# EAGLE design motor_driver_v3.0 (EAGLE 6.5.0)
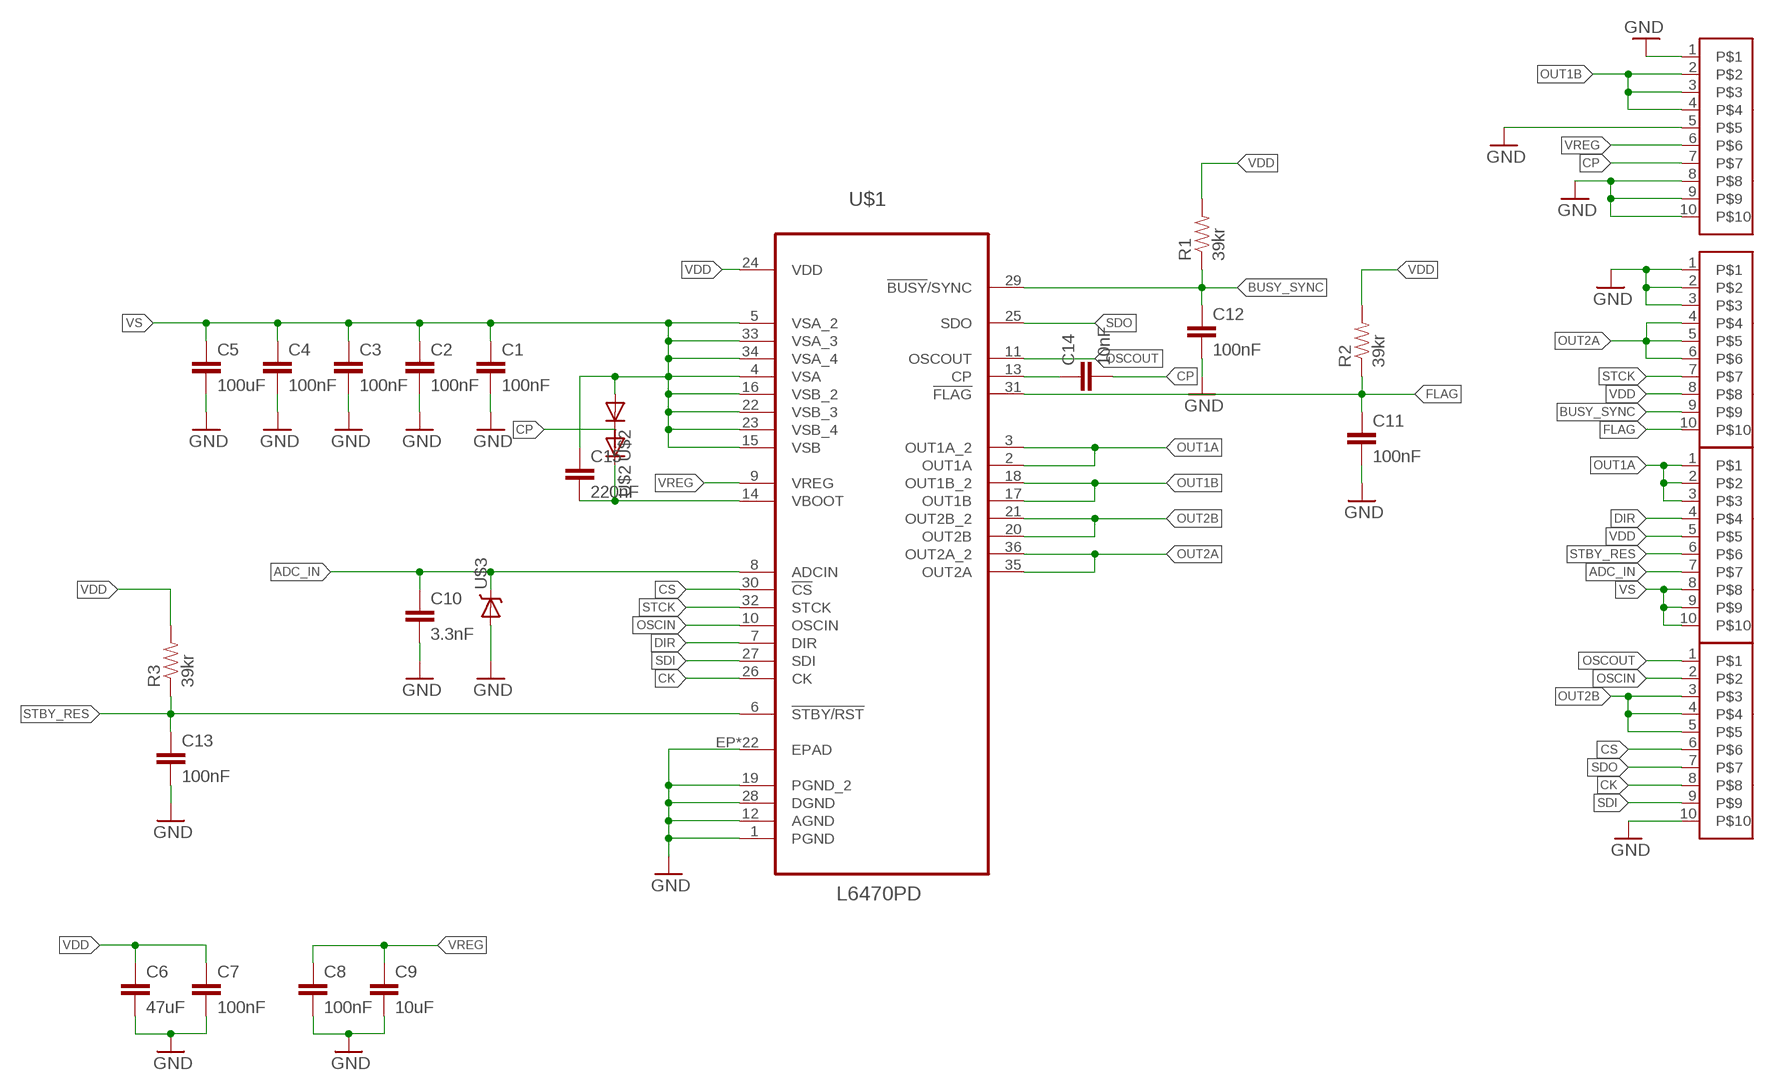
[diagram p0: schematic, sheet 1]

## Parts
C1  100nF  CAP0805  [0805-CAP]
C2  100nF  CAP0805  [0805-CAP]
C3  100nF  CAP0805  [0805-CAP]
C4  100nF  CAP0805  [0805-CAP]
C5  100uF  CAP  [CAP-10X12]
C6  47uF  CAP1206  [1206-CAP]
C7  100nF  CAP0805  [0805-CAP]
C8  100nF  CAP0805  [0805-CAP]
C9  10uF  CAP0805  [0805-CAP]
C10  3.3nF  CAP0805  [0805-CAP]
C11  100nF  CAP0805  [0805-CAP]
C12  100nF  CAP0805  [0805-CAP]
C13  100nF  CAP0805  [0805-CAP]
C14  10nF  CAP0805  [0805-CAP]
C15  220nF  CAP0805  [0805-CAP]
R1  39kr  RESISTOR  [0805]
R2  39kr  RESISTOR  [0805]
R3  39kr  RESISTOR  [0805]
U$1  L6470PD  [SOP65P1400X360-37N]
U$2  BAV99  [BAV99]
U$3  BZX585  [BZX585]
U$4  CON_TH_10PINS  [CON_TH_10POS]
U$5  CON_TH_10PINS  [CON_TH_10POS]
U$6  CON_TH_10PINS  [CON_TH_10POS]
U$7  CON_TH_10PINS  [CON_TH_10POS]

## Nets
ADC_IN: C10.P$1 U$1.8(ADCIN) U$3.P$1 U$4.7
BUSY_SYNC: C12.P$1 R1.1 U$1.29(!BUSY!/SYNC) U$5.9
CK: U$1.26(CK) U$7.8
CP: C14.P$2 U$2.P$3 U$6.7
CS: U$1.30(!CS) U$7.6
DIR: U$1.7(DIR) U$4.4
FLAG: C11.P$1 R2.1 U$1.31(!FLAG) U$5.10
GND: C1.P$2 C2.P$2 C3.P$2 C4.P$2 C5.P$2 C6.P$2 C7.P$2 C8.P$2 C9.P$2 C10.P$2 C11.P$2 C12.P$2 C13.P$2 U$1.1(PGND) U$1.12(AGND) U$1.19(PGND_2) U$1.28(DGND) U$1.EP(EPAD) U$1.VIA1(EPAD) U$1.VIA2(EPAD) U$1.VIA3(EPAD) U$1.VIA4(EPAD) U$1.VIA5(EPAD) U$1.VIA6(EPAD) U$1.VIA7(EPAD) U$1.VIA8(EPAD) U$1.VIA9(EPAD) U$1.VIA10(EPAD) U$1.VIA11(EPAD) U$1.VIA12(EPAD) U$1.VIA13(EPAD) U$1.VIA14(EPAD) U$1.VIA15(EPAD) U$1.VIA16(EPAD) U$1.VIA17(EPAD) U$1.VIA18(EPAD) U$1.VIA19(EPAD) U$1.VIA20(EPAD) U$1.VIA21(EPAD) U$3.P$2 U$5.1 U$5.2 U$5.3 U$6.1 U$6.5 U$6.8 U$6.9 U$6.10 U$7.10
N$1: C15.P$2 U$1.14(VBOOT) U$2.P$2
N$2: C14.P$1 U$1.13(CP)
OSCIN: U$1.10(OSCIN) U$7.2
OSCOUT: U$1.11(OSCOUT) U$7.1
OUT1A: U$1.2(OUT1A) U$1.3(OUT1A_2) U$4.1 U$4.2 U$4.3
OUT1B: U$1.17(OUT1B) U$1.18(OUT1B_2) U$6.2 U$6.3 U$6.4
OUT2A: U$1.35(OUT2A) U$1.36(OUT2A_2) U$5.4 U$5.5 U$5.6
OUT2B: U$1.20(OUT2B) U$1.21(OUT2B_2) U$7.3 U$7.4 U$7.5
SDI: U$1.27(SDI) U$7.9
SDO: U$1.25(SDO) U$7.7
STBY_RES: C13.P$1 R3.1 U$1.6(!STBY/RST) U$4.6
STCK: U$1.32(STCK) U$5.7
VDD: C6.P$1 C7.P$1 R1.2 R2.2 R3.2 U$1.24(VDD) U$4.5 U$5.8
VREG: C8.P$1 C9.P$1 U$1.9(VREG) U$6.6
VS: C1.P$1 C2.P$1 C3.P$1 C4.P$1 C5.P$1 C15.P$1 U$1.4(VSA) U$1.5(VSA_2) U$1.15(VSB) U$1.16(VSB_2) U$1.22(VSB_3) U$1.23(VSB_4) U$1.33(VSA_3) U$1.34(VSA_4) U$2.P$1 U$4.8 U$4.9 U$4.10

## Library data of the parts
C1-C15 = Usefull_ICs:CAP: Capacitor Standard 0603 ceramic capacitor, and 0.1" leaded capacitor.
R1-R3 = Usefull_ICs:RESISTOR: Resistor Basic schematic elements and footprints for 0603, 1206, and PTH 1/10th watt (small) resistors.
U$1 = Usefull_ICs:L6470PD
U$2 = Usefull_ICs:BAV99
U$3 = Usefull_ICs:BZX585
U$4-U$7 = Usefull_ICs:CON_TH_10PINS

## Board
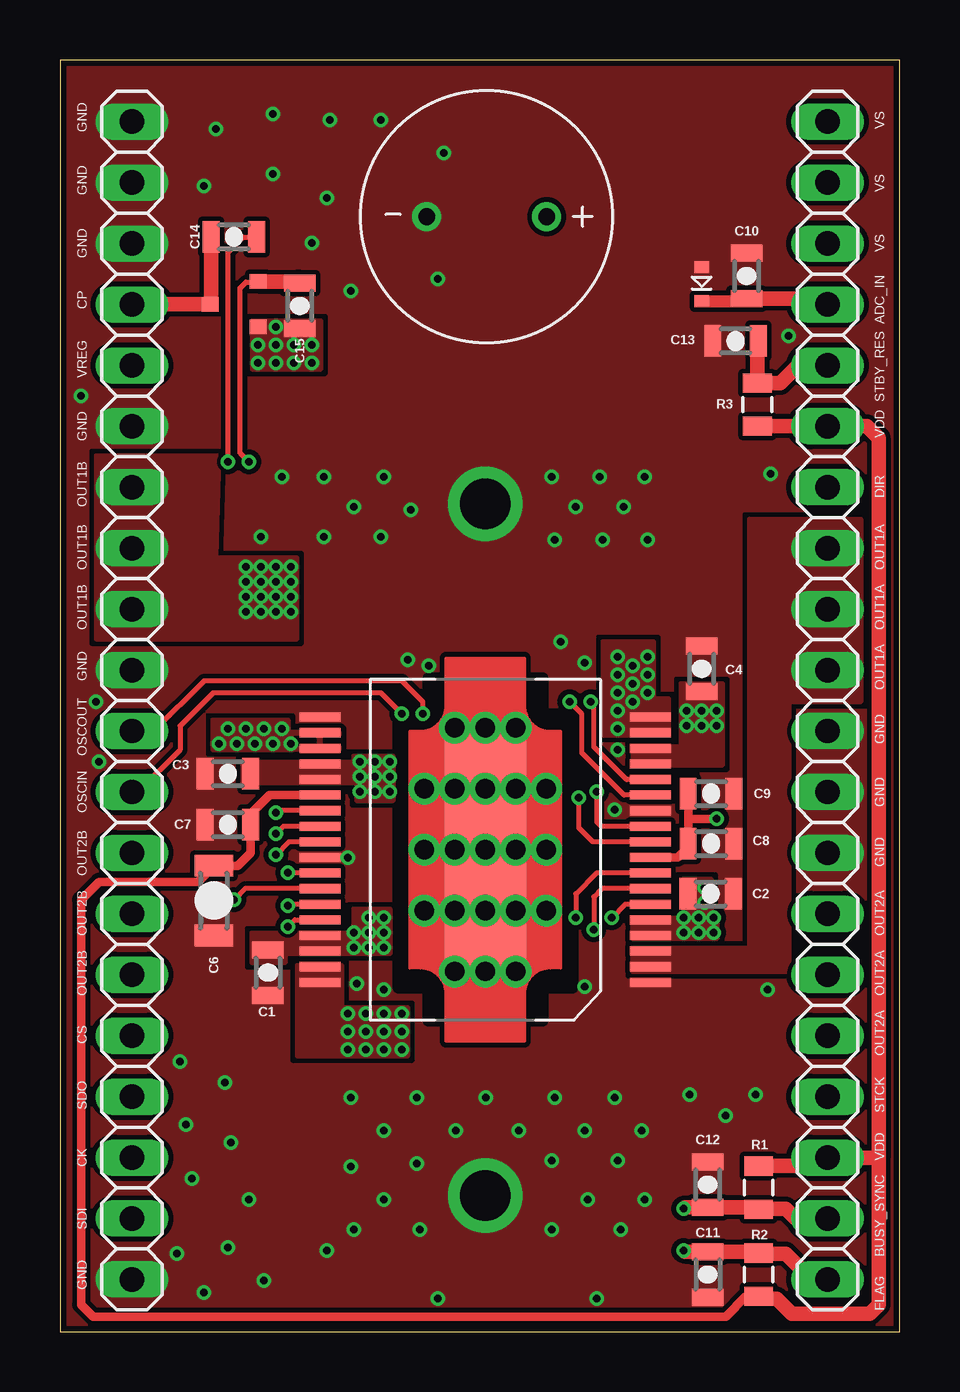
[diagram p1: board, top side]
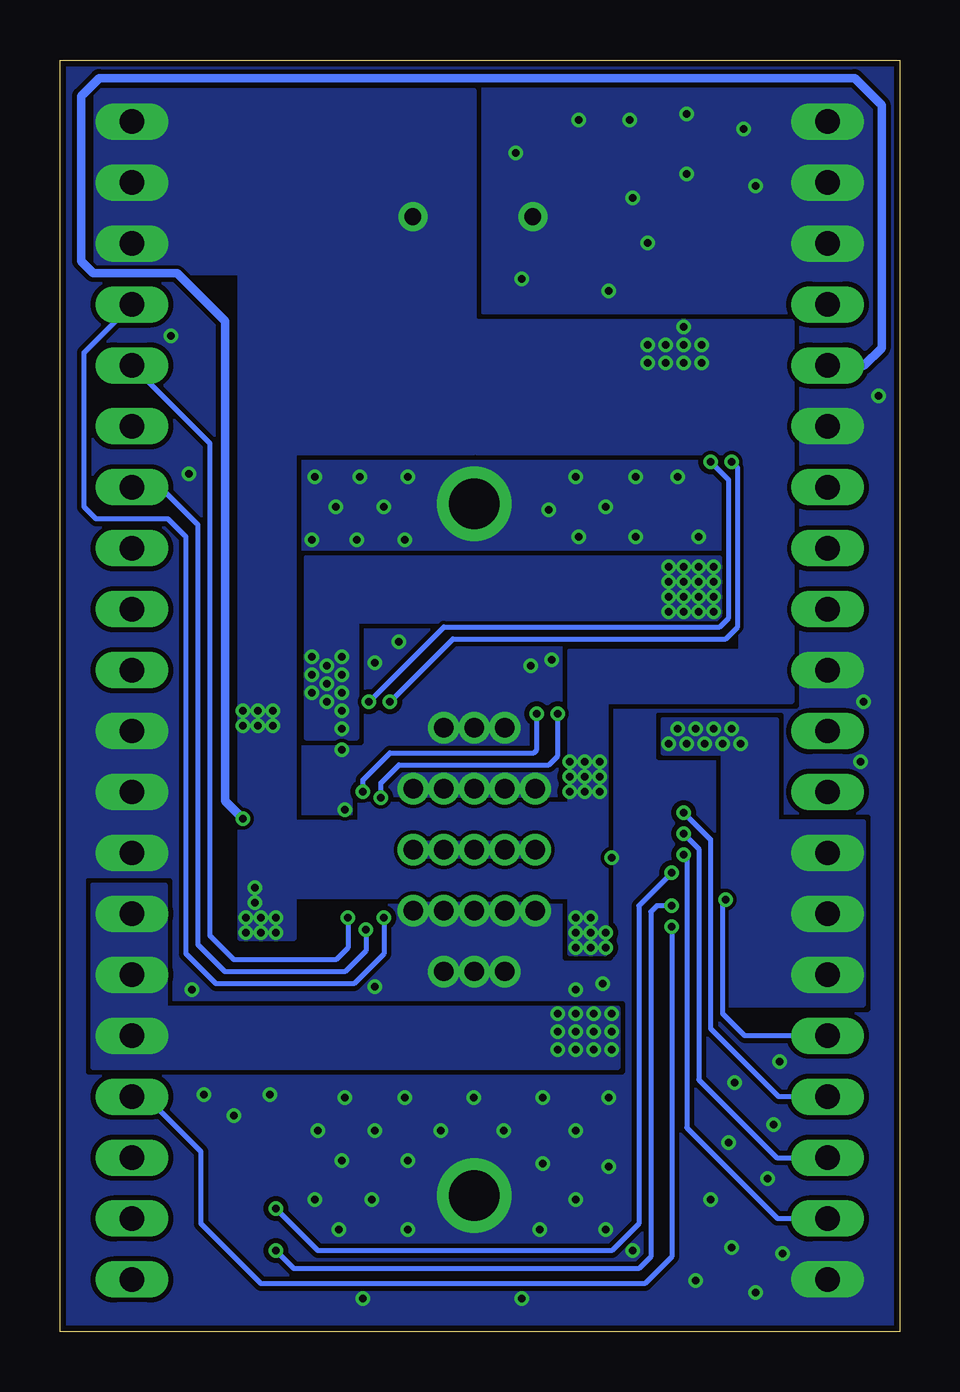
[diagram p2: board, bottom side, seen from below]

Size 35 x 53 mm. Coordinates in mm from the lower left corner, seen from the top.
Outline: 0,0 35,0 35,53 0,53 0,0
Copper layers (1*16): Top 0.035mm / dielectric 1.5mm / Bottom 0.035mm
Design rules "SeeedStudio_2layer_DRU_no_angle_20140221": minimum track width 6mil, minimum drill 12mil, track to track 6mil, track to pad 6mil, pad to pad 6mil, via to via 6mil, smd to smd 0mil, copper to edge 10mil, drill to drill 10mil, minimum pad ring 10mil, minimum via ring 6mil, stop-mask expansion 2mil, vias tented up to drill 100mil, thermal gap 10mil

### Footprints (pad centres in the part's own frame; a part is rotated, then mirrored left to right if it is on the bottom)
0805-CAP = smd 0.7 x 1.3: P$1 -0.95,0; P$2 0.95,0
CAP-10X12 = drill 0.7: P$1 -2.5,0; P$2 2.5,0
1206-CAP = smd 0.9 x 1.6: P$1 -1.45,0; P$2 1.45,0
0805 = smd 0.8 x 1.2: 1 -0.9,0; 2 0.9,0
SOP65P1400X360-37N = smd 0.38 x 1.7: 1 -5.525,-6.883; 2 -4.875,-6.883; 3 -4.225,-6.883; 4 -3.575,-6.883; 5 -2.925,-6.883; 6 -2.275,-6.883; 7 -1.625,-6.883; 8 -0.975,-6.883; 9 -0.325,-6.883; 10 0.325,-6.883; 11 0.975,-6.883; 12 1.625,-6.883; 13 2.275,-6.883; 14 2.925,-6.883; 15 3.575,-6.883; 16 4.225,-6.883; 17 4.875,-6.883; 18 5.525,-6.883; 19 5.525,6.883; 20 4.875,6.883; 21 4.225,6.883; 22 3.575,6.883; 23 2.925,6.883; 24 2.275,6.883; 25 1.625,6.883; 26 0.975,6.883; 27 0.325,6.883; 28 -0.325,6.883; 29 -0.975,6.883; 30 -1.625,6.883; 31 -2.275,6.883; 32 -2.925,6.883; 33 -3.575,6.883; 34 -4.225,6.883; 35 -4.875,6.883; 36 -5.525,6.883 | smd 10 x 3.4: EP 0,0 | drill 0.8 pad 1.27: VIA1 -5.08,1.27; VIA2 -5.08,0; VIA3 -5.08,-1.27; VIA4 -2.54,2.54; VIA5 -2.54,1.27; VIA6 -2.54,0; VIA7 -2.54,-1.27; VIA8 -2.54,-2.54; VIA9 0,2.54; VIA10 0,1.27; VIA11 0,0; VIA12 0,-1.27; VIA13 0,-2.54; VIA14 2.54,2.54; VIA15 2.54,1.27; VIA16 2.54,0; VIA17 2.54,-1.27; VIA18 2.54,-2.54; VIA19 5.08,1.27; VIA20 5.08,0; VIA21 5.08,-1.27
BAV99 = smd 0.6 x 0.7: P$1 0.95,1; P$2 -0.95,1; P$3 0,-1
BZX585 = smd 0.5 x 0.6: P$1 -0.7,0; P$2 0.7,0
CON_TH_10POS = drill 1.016 long: 1 -11.43,0; 2 -8.89,0; 3 -6.35,0; 4 -3.81,0; 5 -1.27,0; 6 1.27,0; 7 3.81,0; 8 6.35,0; 9 8.89,0; 10 11.43,0

### Placement (x,y rotation side)
C1  8.67,14.96 270 top
C2  27.12,18.25 0 top
C3  7,23.25 180 top
C4  26.75,27.62 90 top
C5  17.79,46.47 180 top
C6  6.41,17.96 270 top
C7  7,21.12 180 top
C8  27.14,20.34 0 top
C9  27.14,22.42 0 top
C10  28.62,44 90 top
C11  27,2.38 270 top
C12  27,6.12 90 top
C13  28.16,41.29 180 top
C14  7.25,45.62 180 top
C15  10,42.75 90 top
R1  29.12,6 90 top
R2  29.12,2.38 270 top
R3  29.07,38.63 270 top
U$1  17.73,20.09 90 top
U$2  7.26,42.82 270 top
U$3  26.75,43.66 90 top
U$4  32,39 90 top
U$5  32,13.6 270 top
U$6  3,39 90 top
U$7  3,13.6 270 top

### Tracks (layer width: path | path; a pad name or v marks a point on that pad's centre or on a via)
ADC_IN  (via drill 0.3)
  Top 0.2: U$1.8 22.36,19.11 21.5,18.25 v21.5,17.25
  Top 0.5: U$3.P$1 28.53,42.95 C10.P$1
  Top 0.6: U$4.7 31.76,43.05 C10.P$1
  Bottom 0.2: v21.5,17.25 21.5,15.75 22.75,14.5 28.5,14.5 29.75,15.75 29.75,33.12 30.5,33.88 33.5,33.88 34,34.38 34,40.81 U$4.7
BUSY_SYNC  (via drill 0.3)
  Top 0.2: U$1.29 9.52,19.11 v9.5,19.12
  Top 0.6: R1.1 29.05,5.17 28.62,5.17 | 28.62,5.17 C12.P$1 26.05,5.17 v26,5.12 | U$5.9 30.66,4.71 30.25,5.12 28.68,5.12 28.62,5.17
  Bottom 0.2: v9.5,19.12 10.88,17.75 10.88,4.5 12,3.38 24.25,3.38 v26,5.12
CK  (via drill 0.3)
  Top 0.2: U$1.26 9.31,21.06 v9,20.75
  Bottom 0.2: v9,20.75 8.38,20.12 8.38,10.5 5.12,7.25 U$7.8
CP
  Top 0.6: U$6.7 U$2.P$3 6.3,42.86 C14.P$2
CS  (via drill 0.3)
  Top 0.2: U$1.30 7.71,18.46 v7.25,18
  Bottom 0.2: U$7.6 6.46,12.33 7.38,13.25 7.38,17.88 v7.25,18
DIR  (via drill 0.3)
  Top 0.2: U$1.7 22.59,18.46 22.25,18.12 v22.25,16.75
  Bottom 0.2: v22.25,16.75 22.25,15.88 23.12,15 28.12,15 29.25,16.12 29.25,33.62 30.82,35.19 U$4.4
FLAG  (via drill 0.3)
  Top 0.2: U$1.31 9.56,17.81 v9.5,17.75
  Top 0.6: U$5.10 31.33,2.17 30.25,3.25 29.15,3.25 R2.1 29.07,3.33 C11.P$1 26.05,3.33 v26,3.38
  Bottom 0.2: v9.5,17.75 10.12,17.75 10.38,17.5 10.38,3.12 10.88,2.62 25.25,2.62 v26,3.38
GND  (via drill 0.3, 2.1)
  Top 0.35: U$1.28 v11.99,19.76 v12,19.75
  other vias: 23.12,21.75 6.5,50.12 8.88,48.25 6,47.75 11.25,50.5 11.12,47.25 12.12,43.38 10.5,45.38 8.88,50.75 0.88,39 1.5,26.25 1.62,23.75 14.5,28 15.38,27.75 20.88,28.75 21.88,27.88 23.25,24.25 21.88,14.38 12.38,14.5 13.5,14.25 5,11.25 5.25,8.62 6.88,10.38 7.12,7.88 5.5,6.38 4.88,3.25 7.88,5.5 7,3.5 6,1.62 8.5,2.12 11.12,3.38 15,4.25 23.25,7.12 15.75,1.38 14.88,7 13.5,8.38 12.12,9.75 23.12,9.75 20.62,9.75 21.88,8.38 27.75,9 24.25,8.38 14.88,9.75 26.25,9.88 22,5.5 22.38,1.38 29.5,14.25 29.62,35.75 8.38,33.12 9.25,35.62 11,33.12 11,35.62 14.62,34.25 22.5,35.62 21.5,34.38 22.62,33 15.75,43.88 16,49.12 13.38,50.5 30.38,41.5 12.12,6.88 16.5,8.38 17.75,9.75 20.5,7.12 19.12,8.38 29,9.88 13.5,35.62 12.25,34.38 20.5,35.62 20.62,33 24.5,33 23.5,34.38 24.38,35.62 17.73,34.5 17.73,5.67 13.38,33.12 12.25,4.25 13.5,5.5 20.5,4.25 23.38,4.25 24.38,5.5
  pour Top (isolate 0.2, rank 2, no thermals): -1,-1.12 -1,55 36,55 36,-1.12
  pour Bottom (isolate 0.2, rank 2, no thermals): 36,55 36,-1.12 -1,-1.12 -1,55
N$1  (via drill 0.3)
  Top 0.2: U$1.14 23.61,23.01 22.25,24.38 22.25,26.12 v22.12,26.25 | U$2.P$2 8.24,43.75 7.75,43.75 7.5,43.5 7.5,36.62 v7.88,36.25
  Top 0.6: U$2.P$2 9.93,43.77 C15.P$2
  Bottom 0.2: v22.12,26.25 19,29.38 7.5,29.38 7.12,29.75 7.12,35.5 v7.88,36.25
N$2  (via drill 0.3)
  Top 0.2: U$1.13 23.52,22.36 21.75,24.12 21.75,25.75 v21.25,26.25 | C14.P$1 7.62,45.62 7,45 v7,36.25
  Bottom 0.2: v21.25,26.25 18.62,28.88 7.25,28.88 6.75,29.38 6.75,36 v7,36.25
OSCIN  (via drill 0.3)
  Top 0.2: U$1.10 22.21,20.41 21.62,21 v21.62,22.25 | v14.25,25.75 13.38,26.62 6.38,26.62 5,25.25 5,24.25 3.24,22.49 U$7.2
  Bottom 0.2: v21.62,22.25 21.62,22.88 20.88,23.62 14.62,23.62 14.25,24 v14.25,25.75
OSCOUT  (via drill 0.3)
  Top 0.2: U$1.11 22.57,21.06 22.38,21.25 v22.38,22.5 | v15.12,25.75 15.12,26.25 14.25,27.12 6,27.12 3.9,25.03 U$7.1
  Bottom 0.2: v22.38,22.5 22.38,23 21.25,24.12 15.25,24.12 15.12,24.25 v15.12,25.75
OUT1A
  pour Top (no thermals): 23.88,16 28.75,16 28.75,33.88 33.38,33.88 33.38,26.25 30.38,26.25 30.38,15 23.88,15
OUT1B  (via drill 0.3)
  other vias: 23.25,26.62 23.88,26.25 24.5,26.62 23.88,27 23.25,27.38 24.5,27.38 23.88,27.75 23.25,28.12 24.5,28.12 8.38,30 8.38,31.25 7.75,30 9,31.88 9,31.25 9,30.62 9,30 8.38,31.88 9.62,31.88 9.62,30 9.62,30.62 9.62,31.25 7.75,30.62 8.38,30.62 7.75,31.25 7.75,31.88 23.25,25.88 23.25,25.12
  pour Bottom: 24.75,24.75 22.62,24.75 22.62,29.62 7.5,29.62 7.5,32.25 24.75,32.25
  pour Top (no thermals): 25.38,24.88 25.38,26.38 24.75,26.38 24.75,28.75 22.62,28.75 22.62,24.88
  pour Top (no thermals): 6.62,36.5 1.5,36.5 1.5,28.88 9.88,28.88 9.88,32.25 6.5,32.25
OUT2A  (via drill 0.3)
  other vias: 14.25,13.25 13.5,13.25 12,13.25 14.25,12.5 12.75,13.25 12,12.5 12,11.75 12.75,12.5 13.5,12.5 14.25,11.75 12.75,11.75 13.5,11.75
  pour Bottom (no thermals): 33.62,18.62 30.62,18.62 30.62,13.5 11.75,13.5 11.75,11 33.62,11
  pour Top (no thermals): 9.88,15.25 9.88,11.5 14.5,11.5 14.5,13.5 11.75,13.5 11.75,15.25
OUT2B  (via drill 0.3)
  other vias: 8.5,25.12 8.88,24.5 8.12,24.5 7.75,25.12 7.38,24.5 9.25,25.12 9.62,24.5 7,25.12 6.62,24.5
  pour Bottom (no thermals): 9.88,24.12 7.38,24.12 7.38,13.62 1.5,13.62 1.5,21.25 5.12,21.25 5.12,25.5 9.88,25.5
  pour Top: 11.62,24.25 6.38,24.25 6.38,25.5 9.5,25.5 9.5,25 11.62,25
SDI  (via drill 0.3)
  Top 0.2: U$1.27 9.54,20.41 v9,19.88
  Bottom 0.2: v9,19.88 8.88,19.75 8.88,8.5 5.08,4.71 U$7.9
SDO  (via drill 0.3)
  Top 0.2: U$1.25 9.09,21.71 v9,21.62
  Bottom 0.2: v9,21.62 7.88,20.5 7.88,12.62 5.04,9.79 U$7.7
STBY_RES  (via drill 0.3)
  Top 0.2: U$1.6 23.56,17.81 v23,17.25
  Top 0.6: U$4.6 30.77,40.27 30.04,39.53 R3.1 29.07,41.25 C13.P$1
  Bottom 0.2: v23,17.25 23,16 23.5,15.5 27.75,15.5 28.75,16.5 28.75,37.02 U$4.6
STCK  (via drill 0.3)
  Top 0.2: v9.5,16.88 9.79,17.16 U$1.32
  Bottom 0.2: v9.5,16.88 9.5,3.12 10.62,2 26.62,2 29.12,4.5 29.12,7.5 31.41,9.79 U$5.7
VDD
  Top 0.35: U$1.24 8.73,22.36 7.95,21.57 C7.P$1 7.95,19.95 7.41,19.41 C6.P$1 5.75,18.75 1.62,18.75 0.88,18 0.88,1.12 1.38,0.62 27.75,0.62 28.6,1.48 R2.2
  Top 0.6: R3.2 U$4.5 33.65,37.73 34.12,37.25 34.12,7.25 | 34.12,7.25 U$5.8 31.65,6.9 R1.2 | 34.12,7.25 34.12,1.12 33.75,0.75 30.5,0.75 29.88,1.38 29.23,1.38 R2.2
VREG  (via drill 0.3)
  Top 0.35: U$1.9 25.76,19.76 26.19,20.19 C8.P$1 C9.P$1 26.19,21.43 26.25,21.38 v27.38,21.38
  Bottom 0.35: v27.38,21.38 28.12,22.12 28.12,42.12 30.12,44.12 33.62,44.12 34.12,44.62 34.12,51.5 33.38,52.25 1.88,52.25 0.75,51.12 0.75,41 1.48,40.27 U$6.6
VS  (via drill 0.3)
  other vias: 12.88,16 12.25,16.62 13.5,16.62 13.5,16 12.25,16 12.5,23.12 12.5,22.5 13.12,22.5 12.5,23.75 13.12,23.12 26.88,18.5 26,16.62 26,17.25 26.62,17.25 26.88,17.88 26.75,25.25 26.12,25.88 26.75,25.88 27.38,25.88 26.12,25.25 8.25,41.12 9,41.12 9,40.38 9.75,41.12 9.75,40.38 10.5,40.38 10.5,41.12 8.25,40.38 9,41.88 12.88,16.62 12.88,17.25 13.5,17.25 27.38,25.25 26.62,16.62 27.25,17.25 27.25,16.62 13.75,23.12 13.12,23.75 13.75,23.75 13.75,22.5
  pour Bottom (no thermals): 25.25,36.62 25.25,21.25 22.5,21.25 22.5,22 13.75,22 13.75,28.38 6.62,28.38 6.62,36.62 17.62,36.62 17.62,42.12 4.5,42.12 4.5,26.25 12.25,26.25 12.25,15.75 13.75,15.75 13.75,18.12 25.25,18.12 25.25,16.38 27.5,16.38 27.5,44.12 33.5,44.12 33.5,51.75 17.75,51.75 17.75,36.62
  pour Top (no thermals): 8,16.62 12.25,16.62 12.25,17.62 13.75,17.62 13.75,15.75 9.38,15.75 9.38,15.38 8,15.38
  pour Top (no thermals): 7.62,23.75 12.25,23.75 12.25,24 13.88,24 13.88,22.12 12.38,22.12 12.38,22.88 7.62,22.88
  pour Top (no thermals): 23.88,23.62 27.62,23.62 27.62,27 25.88,27 25.88,24.38 23.88,24.38
  pour Top (no thermals): 23.88,17.25 26,17.25 26,18.88 27.12,18.88 27.12,17.38 27.38,17.38 27.38,16.38 23.88,16.38
  pour Top (no thermals): 8,42.12 8,40.12 10.62,40.12 10.88,40.12 10.88,42.12

### Text on the board
tNames: GND | VS | VS | GND | GND | VS | CP | ADC_IN | VREG | STBY_RES | GND | VDD | DIR | OUT1B | OUT1B | OUT1A | OUT1B | OUT1A | GND | OUT1A | OSCOUT | GND | OSCIN | GND | OUT2B | GND | OUT2B | OUT2A | OUT2B | OUT2A | CS | OUT2A | SDO | STCK | CK | VDD | SDI | BUSY_SYNC | GND | FLAG